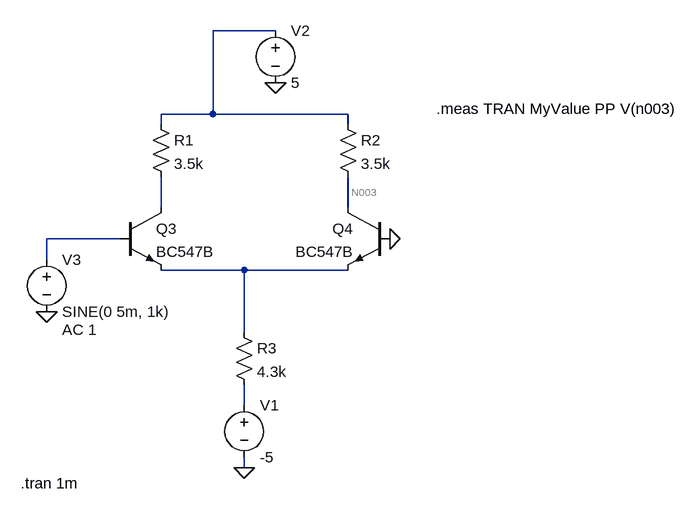
[diagram p0: schematic DIFF_AMP.asc]
DIFF_AMP.asc, the LTspice schematic file:
Version 4
SHEET 1 1404 772
WIRE 768 -560 672 -560
WIRE 672 -432 672 -560
WIRE 672 -432 592 -432
WIRE 880 -432 672 -432
WIRE 592 -416 592 -432
WIRE 880 -416 880 -432
WIRE 592 -288 592 -336
WIRE 880 -288 880 -336
WIRE 528 -240 416 -240
WIRE 416 -208 416 -240
WIRE 720 -192 592 -192
WIRE 880 -192 720 -192
WIRE 720 -96 720 -192
WIRE 720 16 720 -16
WIRE 720 112 720 96
FLAG 720 112 0
FLAG 768 -480 0
FLAG 944 -240 0
FLAG 416 -128 0
SYMBOL npn 528 -288 R0
SYMATTR InstName Q3
SYMATTR Value BC547B
SYMBOL npn 944 -288 M0
SYMATTR InstName Q4
SYMATTR Value BC547B
SYMBOL res 576 -432 R0
SYMATTR InstName R1
SYMATTR Value 3.5k
SYMBOL res 864 -432 R0
SYMATTR InstName R2
SYMATTR Value 3.5k
SYMBOL res 704 -112 R0
SYMATTR InstName R3
SYMATTR Value 4.3k
SYMBOL voltage 720 0 R0
SYMATTR InstName V1
SYMATTR Value -5
SYMBOL voltage 768 -576 R0
SYMATTR InstName V2
SYMATTR Value 5
SYMBOL voltage 416 -224 R0
WINDOW 123 24 124 Left 2
WINDOW 39 0 0 Left 0
SYMATTR Value2 AC 1
SYMATTR InstName V3
SYMATTR Value SINE(0 5m, 1k)
TEXT 376 136 Left 2 !.tran 1m
TEXT 1016 -440 Left 2 !.meas TRAN MyValue PP V(n003)

The netlist it stands for:
* DIFF_AMP.asc
Q3 N002 N004 N005 0 BC547B
Q4 N003 0 N005 0 BC547B
R1 N001 N002 3.5k
R2 N001 N003 3.5k
R3 N005 N006 4.3k
V1 N006 0 -5
V2 N001 0 5
V3 N004 0 SINE(0 5m, 1k) AC 1
.model NPN NPN
.model PNP PNP
.lib standard.bjt
.tran 1m
.meas TRAN MyValue PP V(n003)
.backanno
.end